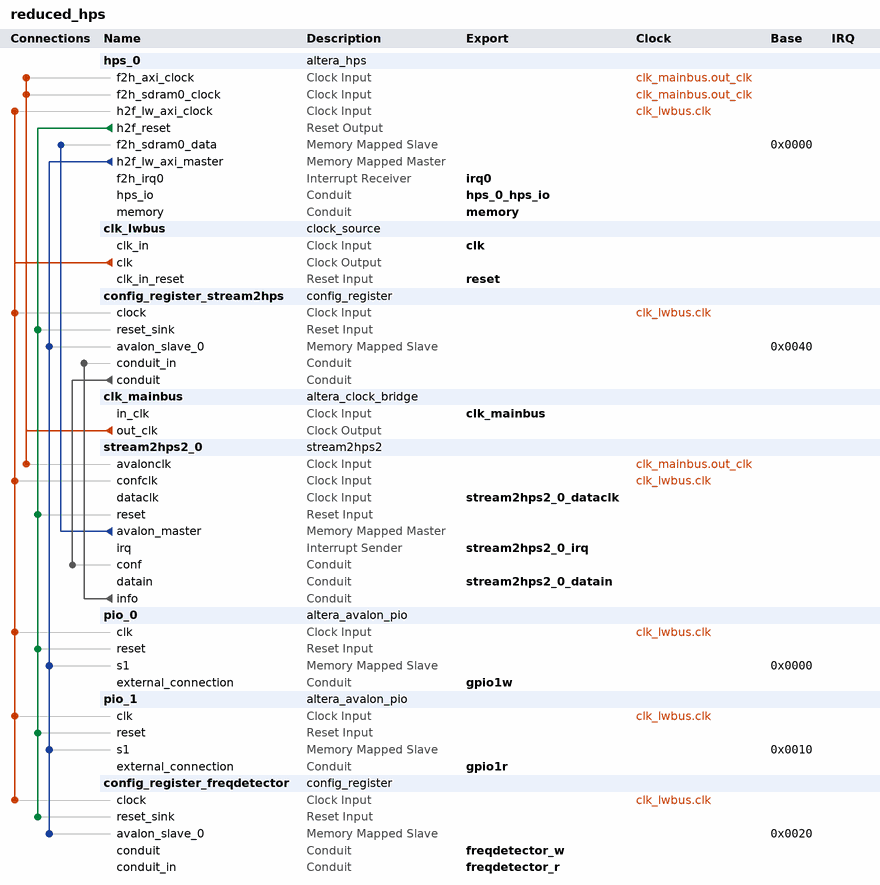
[diagram p0: system contents]
# Platform Designer (Qsys) system reduced_hps, Cyclone V 5CSEMA5F31C6
# Parameters at their usual value, and those the tool derives, are not listed.
package require -exact qsys 15.1
create_system reduced_hps
set_project_property DEVICE_FAMILY {Cyclone V}
set_project_property DEVICE 5CSEMA5F31C6

add_instance hps_0 altera_hps 15.1
set_instance_parameter_value hps_0 EMAC1_Mode RGMII
set_instance_parameter_value hps_0 EMAC1_PinMuxing {HPS I/O Set 0}
set_instance_parameter_value hps_0 F2SCLK_COLDRST_Enable false
set_instance_parameter_value hps_0 F2SCLK_DBGRST_Enable false
set_instance_parameter_value hps_0 F2SCLK_WARMRST_Enable false
set_instance_parameter_value hps_0 F2SDRAM_Type {Avalon-MM Write-Only}
set_instance_parameter_value hps_0 F2SDRAM_Width 64
set_instance_parameter_value hps_0 F2SINTERRUPT_Enable true
set_instance_parameter_value hps_0 F2S_Width 2
set_instance_parameter_value hps_0 FPGA_PERIPHERAL_OUTPUT_CLOCK_FREQ_EMAC0_GTX_CLK 100
set_instance_parameter_value hps_0 FPGA_PERIPHERAL_OUTPUT_CLOCK_FREQ_EMAC0_MD_CLK 100.0
set_instance_parameter_value hps_0 FPGA_PERIPHERAL_OUTPUT_CLOCK_FREQ_EMAC1_GTX_CLK 100
set_instance_parameter_value hps_0 FPGA_PERIPHERAL_OUTPUT_CLOCK_FREQ_EMAC1_MD_CLK 100.0
set_instance_parameter_value hps_0 HPS_PROTOCOL DDR3
set_instance_parameter_value hps_0 I2C0_Mode I2C
set_instance_parameter_value hps_0 I2C0_PinMuxing {HPS I/O Set 0}
set_instance_parameter_value hps_0 I2C1_Mode I2C
set_instance_parameter_value hps_0 I2C1_PinMuxing {HPS I/O Set 0}
set_instance_parameter_value hps_0 LWH2F_Enable true
set_instance_parameter_value hps_0 MEM_BANKADDR_WIDTH 3
set_instance_parameter_value hps_0 MEM_CLK_FREQ 400.0
set_instance_parameter_value hps_0 MEM_COL_ADDR_WIDTH 10
set_instance_parameter_value hps_0 MEM_DQ_WIDTH 32
set_instance_parameter_value hps_0 MEM_DRV_STR RZQ/7
set_instance_parameter_value hps_0 MEM_ROW_ADDR_WIDTH 15
set_instance_parameter_value hps_0 MEM_RTT_NOM RZQ/4
set_instance_parameter_value hps_0 MEM_RTT_WR RZQ/4
set_instance_parameter_value hps_0 MEM_TCL 11
set_instance_parameter_value hps_0 MEM_TFAW_NS 30.0
set_instance_parameter_value hps_0 MEM_TRAS_NS 35.0
set_instance_parameter_value hps_0 MEM_TRCD_NS 13.75
set_instance_parameter_value hps_0 MEM_TRFC_NS 260.0
set_instance_parameter_value hps_0 MEM_TRP_NS 13.75
set_instance_parameter_value hps_0 MEM_VENDOR JEDEC
set_instance_parameter_value hps_0 MEM_WTCL 8
set_instance_parameter_value hps_0 QSPI_Mode {1 SS}
set_instance_parameter_value hps_0 QSPI_PinMuxing {HPS I/O Set 0}
set_instance_parameter_value hps_0 REF_CLK_FREQ 25.0
set_instance_parameter_value hps_0 S2FCLK_USER2CLK 4
set_instance_parameter_value hps_0 S2F_Width 0
set_instance_parameter_value hps_0 SDIO_Mode {4-bit Data}
set_instance_parameter_value hps_0 SDIO_PinMuxing {HPS I/O Set 0}
set_instance_parameter_value hps_0 SPIM1_Mode {Single Slave Select}
set_instance_parameter_value hps_0 SPIM1_PinMuxing {HPS I/O Set 0}
set_instance_parameter_value hps_0 STM_Enable false
set_instance_parameter_value hps_0 TIMING_BOARD_AC_SKEW 0.03
set_instance_parameter_value hps_0 TIMING_BOARD_AC_TO_CK_SKEW 0.0
set_instance_parameter_value hps_0 TIMING_BOARD_DQ_TO_DQS_SKEW 0.0
set_instance_parameter_value hps_0 TIMING_BOARD_MAX_CK_DELAY 0.03
set_instance_parameter_value hps_0 TIMING_BOARD_MAX_DQS_DELAY 0.02
set_instance_parameter_value hps_0 TIMING_BOARD_SKEW_BETWEEN_DQS 0.08
set_instance_parameter_value hps_0 TIMING_BOARD_SKEW_CKDQS_DIMM_MAX 0.16
set_instance_parameter_value hps_0 TIMING_BOARD_SKEW_CKDQS_DIMM_MIN 0.09
set_instance_parameter_value hps_0 TIMING_BOARD_SKEW_WITHIN_DQS 0.01
set_instance_parameter_value hps_0 TIMING_TDH 65
set_instance_parameter_value hps_0 TIMING_TDQSCK 255
set_instance_parameter_value hps_0 TIMING_TDQSQ 125
set_instance_parameter_value hps_0 TIMING_TDS 30
set_instance_parameter_value hps_0 TIMING_TIH 140
set_instance_parameter_value hps_0 TIMING_TIS 180
set_instance_parameter_value hps_0 TIMING_TQSH 0.4
set_instance_parameter_value hps_0 UART0_Mode {No Flow Control}
set_instance_parameter_value hps_0 UART0_PinMuxing {HPS I/O Set 0}
set_instance_parameter_value hps_0 USB1_Mode SDR
set_instance_parameter_value hps_0 USB1_PinMuxing {HPS I/O Set 0}
set_instance_parameter_value hps_0 desired_cfg_clk_mhz 100.0
set_instance_parameter_value hps_0 desired_qspi_clk_mhz 400.0

add_instance clk_lwbus clock_source 15.1
set_instance_parameter_value clk_lwbus clockFrequency 50000000

add_instance config_register_stream2hps config_register 1.0
set_instance_parameter_value config_register_stream2hps addrlen 2
set_instance_parameter_value config_register_stream2hps dummy 0
set_instance_parameter_value config_register_stream2hps inpWords 1
set_instance_parameter_value config_register_stream2hps words 2

add_instance clk_mainbus altera_clock_bridge 15.1
set_instance_parameter_value clk_mainbus DERIVED_CLOCK_RATE 0
set_instance_parameter_value clk_mainbus EXPLICIT_CLOCK_RATE 0

add_instance stream2hps2_0 stream2hps2 1.0

add_instance pio_0 altera_avalon_pio 15.1
set_instance_parameter_value pio_0 direction Output
set_instance_parameter_value pio_0 width 32

add_instance pio_1 altera_avalon_pio 15.1
set_instance_parameter_value pio_1 direction Input
set_instance_parameter_value pio_1 width 16

add_instance config_register_freqdetector config_register 1.0
set_instance_parameter_value config_register_freqdetector addrlen 2
set_instance_parameter_value config_register_freqdetector dummy 0
set_instance_parameter_value config_register_freqdetector inpWords 2
set_instance_parameter_value config_register_freqdetector words 2

# connections
add_connection clk_lwbus.clk config_register_freqdetector.clock clock
add_connection clk_lwbus.clk config_register_stream2hps.clock clock
add_connection clk_lwbus.clk hps_0.h2f_lw_axi_clock clock
add_connection clk_lwbus.clk pio_0.clk clock
add_connection clk_lwbus.clk pio_1.clk clock
add_connection clk_lwbus.clk stream2hps2_0.confclk clock
add_connection clk_mainbus.out_clk hps_0.f2h_axi_clock clock
add_connection clk_mainbus.out_clk hps_0.f2h_sdram0_clock clock
add_connection clk_mainbus.out_clk stream2hps2_0.avalonclk clock
add_connection hps_0.h2f_reset config_register_freqdetector.reset_sink reset
add_connection hps_0.h2f_reset config_register_stream2hps.reset_sink reset
add_connection hps_0.h2f_reset pio_0.reset reset
add_connection hps_0.h2f_reset pio_1.reset reset
add_connection hps_0.h2f_reset stream2hps2_0.reset reset
add_connection hps_0.h2f_lw_axi_master config_register_freqdetector.avalon_slave_0 avalon
set_connection_parameter_value hps_0.h2f_lw_axi_master/config_register_freqdetector.avalon_slave_0 baseAddress 0x0020
add_connection hps_0.h2f_lw_axi_master config_register_stream2hps.avalon_slave_0 avalon
set_connection_parameter_value hps_0.h2f_lw_axi_master/config_register_stream2hps.avalon_slave_0 baseAddress 0x0040
add_connection hps_0.h2f_lw_axi_master pio_0.s1 avalon
set_connection_parameter_value hps_0.h2f_lw_axi_master/pio_0.s1 baseAddress 0x0000
add_connection hps_0.h2f_lw_axi_master pio_1.s1 avalon
set_connection_parameter_value hps_0.h2f_lw_axi_master/pio_1.s1 baseAddress 0x0010
add_connection stream2hps2_0.avalon_master hps_0.f2h_sdram0_data avalon
set_connection_parameter_value stream2hps2_0.avalon_master/hps_0.f2h_sdram0_data baseAddress 0x0000
add_connection config_register_stream2hps.conduit stream2hps2_0.conf conduit
add_connection stream2hps2_0.info config_register_stream2hps.conduit_in conduit

# exported interfaces
add_interface clk clock sink
set_interface_property clk EXPORT_OF clk_lwbus.clk_in
add_interface clk_mainbus clock sink
set_interface_property clk_mainbus EXPORT_OF clk_mainbus.in_clk
add_interface freqdetector_r conduit end
set_interface_property freqdetector_r EXPORT_OF config_register_freqdetector.conduit_in
add_interface freqdetector_w conduit end
set_interface_property freqdetector_w EXPORT_OF config_register_freqdetector.conduit
add_interface gpio1r conduit end
set_interface_property gpio1r EXPORT_OF pio_1.external_connection
add_interface gpio1w conduit end
set_interface_property gpio1w EXPORT_OF pio_0.external_connection
add_interface hps_0_hps_io conduit end
set_interface_property hps_0_hps_io EXPORT_OF hps_0.hps_io
add_interface irq0 interrupt receiver
set_interface_property irq0 EXPORT_OF hps_0.f2h_irq0
add_interface memory conduit end
set_interface_property memory EXPORT_OF hps_0.memory
add_interface reset reset sink
set_interface_property reset EXPORT_OF clk_lwbus.clk_in_reset
add_interface stream2hps2_0_dataclk clock sink
set_interface_property stream2hps2_0_dataclk EXPORT_OF stream2hps2_0.dataclk
add_interface stream2hps2_0_datain conduit end
set_interface_property stream2hps2_0_datain EXPORT_OF stream2hps2_0.datain
add_interface stream2hps2_0_irq interrupt sender
set_interface_property stream2hps2_0_irq EXPORT_OF stream2hps2_0.irq

set_interconnect_requirement {$system} qsys_mm.clockCrossingAdapter HANDSHAKE
set_interconnect_requirement {$system} qsys_mm.maxAdditionalLatency 1

save_system reduced_hps.qsys
